# EAGLE schematic ESP-32 Stepper Hat v6 (EAGLE 9.7.0)
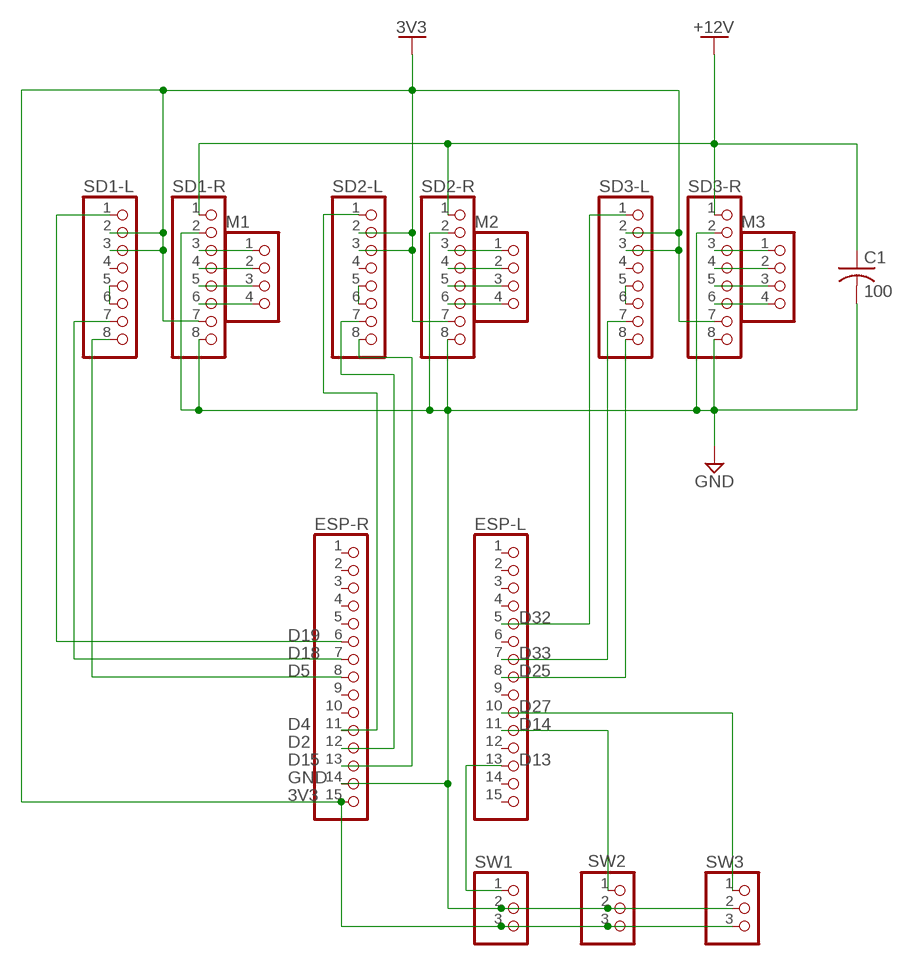
[diagram p0: schematic, sheet 1]

## Parts
C1  100  C-US_RADIAL-12.5MM-DIA  [CAPRD550W60D1025H1250B]
ESP-L  PINHD-1X15  [1X15]
ESP-R  PINHD-1X15  [1X15]
M1  PINHD-1X4  [1X04]
M2  PINHD-1X4  [1X04]
M3  PINHD-1X4  [1X04]
SD1-L  PINHD-1X8  [1X08]
SD1-R  PINHD-1X8  [1X08]
SD2-L  PINHD-1X8  [1X08]
SD2-R  PINHD-1X8  [1X08]
SD3-L  PINHD-1X8  [1X08]
SD3-R  PINHD-1X8  [1X08]
SW1  PINHD-1X3  [1X03]
SW2  PINHD-1X3  [1X03]
SW3  PINHD-1X3  [1X03]

## Nets
3V3: ESP-R.15 SD1-L.2 SD1-L.3 SD1-R.7 SD2-L.2 SD2-L.3 SD2-R.7 SD3-L.2 SD3-L.3 SD3-R.7 SW1.3 SW2.3 SW3.3
+12V: C1.1 SD1-R.1 SD2-R.1 SD3-R.1
D2: ESP-R.12 SD2-L.7
D4: ESP-R.11 SD2-L.1
D5: ESP-R.8 SD1-L.8
D13: ESP-L.13 SW1.1
D14: ESP-L.11 SW2.1
D15: ESP-R.13 SD2-L.8
D18: ESP-R.7 SD1-L.7
D19: ESP-R.6 SD1-L.1
D25: ESP-L.8 SD3-L.8
D27: ESP-L.10 SW3.1
D32: ESP-L.5 SD3-L.1
D33: ESP-L.7 SD3-L.7
GND: C1.2 ESP-R.14 SD1-R.2 SD1-R.8 SD2-R.2 SD2-R.8 SD3-R.2 SD3-R.8 SW1.2 SW2.2 SW3.2
N$2: M3.4 SD3-R.6
N$3: M3.3 SD3-R.5
N$4: M3.2 SD3-R.4
N$5: M3.1 SD3-R.3
N$6: M2.4 SD2-R.6
N$7: M2.3 SD2-R.5
N$8: M2.2 SD2-R.4
N$9: M2.1 SD2-R.3
N$10: M1.4 SD1-R.6
N$11: M1.3 SD1-R.5
N$12: M1.2 SD1-R.4
N$13: M1.1 SD1-R.3
N$16: SD3-L.5 SD3-L.6
N$17: SD2-L.5 SD2-L.6
N$18: SD1-L.5 SD1-L.6
Unconnected: ESP-L.1 ESP-L.2 ESP-L.3 ESP-L.4 ESP-L.6 ESP-L.9 ESP-L.12 ESP-L.14 ESP-L.15 ESP-R.1 ESP-R.2 ESP-R.3 ESP-R.4 ESP-R.5 ESP-R.9 ESP-R.10 SD1-L.4 SD2-L.4 SD3-L.4

## Library data of the parts
C1 = Capacitor:C-US: Capacitor - ANSI; CATEGORY: Capacitor
ESP-L ESP-R = Connector:PINHD-1X15: PIN HEADER; CATEGORY: CONNECTOR; SUB-CATEGORY: PIN-HEADER
M1-M3 = Connector:PINHD-1X4: PIN HEADER; CATEGORY: CONNECTOR; SUB-CATEGORY: PIN-HEADER
SD1-L SD1-R SD2-L SD2-R SD3-L SD3-R = Connector:PINHD-1X8: PIN HEADER; CATEGORY: CONNECTOR; SUB-CATEGORY: PIN-HEADER
SW1-SW3 = Connector:PINHD-1X3: PIN HEADER; CATEGORY: CONNECTOR; SUB-CATEGORY: PIN-HEADER